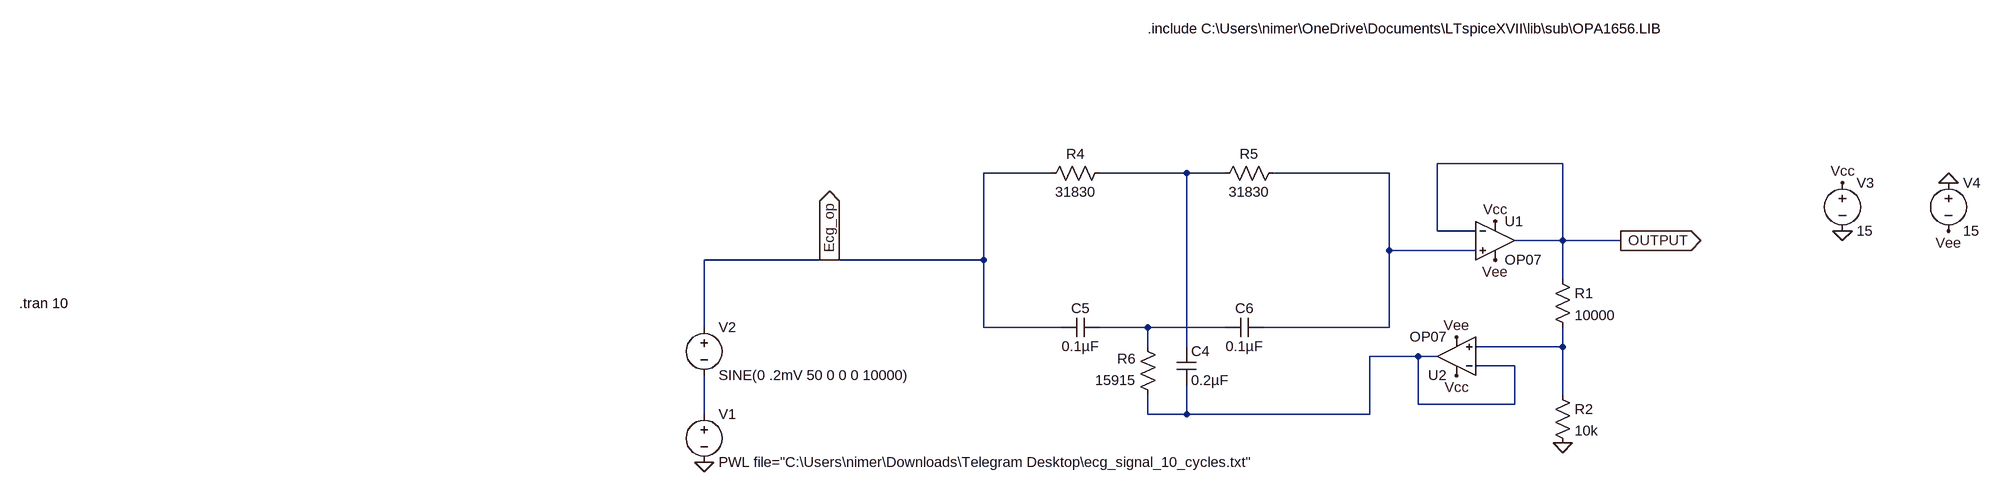
[diagram p0: schematic Twin T notch filter.asc]
Twin T notch filter.asc, the LTspice schematic file:
Version 4
SHEET 1 3288 680
WIRE 2592 16 2384 16
WIRE 1744 32 1632 32
WIRE 1968 32 1824 32
WIRE 2032 32 1968 32
WIRE 2304 32 2112 32
WIRE 2384 128 2384 16
WIRE 2448 128 2384 128
WIRE 2592 144 2592 16
WIRE 2592 144 2512 144
WIRE 2688 144 2592 144
WIRE 2304 160 2304 32
WIRE 2448 160 2304 160
WIRE 1376 176 1168 176
WIRE 1632 176 1632 32
WIRE 1632 176 1376 176
WIRE 2592 208 2592 144
WIRE 1168 288 1168 176
WIRE 1632 288 1632 176
WIRE 1760 288 1632 288
WIRE 1904 288 1824 288
WIRE 2032 288 1904 288
WIRE 2304 288 2304 160
WIRE 2304 288 2096 288
WIRE 1904 320 1904 288
WIRE 1968 320 1968 32
WIRE 2592 320 2592 288
WIRE 2592 320 2448 320
WIRE 2352 336 2272 336
WIRE 2384 336 2352 336
WIRE 2512 352 2448 352
WIRE 2592 400 2592 320
WIRE 2352 416 2352 336
WIRE 2512 416 2512 352
WIRE 2512 416 2352 416
WIRE 1168 432 1168 368
WIRE 1904 432 1904 400
WIRE 1968 432 1968 384
WIRE 1968 432 1904 432
WIRE 2272 432 2272 336
WIRE 2272 432 1968 432
FLAG 1168 512 0
FLAG 1376 176 Ecg_op
IOPIN 1376 176 Out
FLAG 2592 480 0
FLAG 2480 112 Vcc
FLAG 2416 304 Vee
FLAG 2416 368 Vcc
FLAG 2480 176 Vee
FLAG 2688 144 OUTPUT
IOPIN 2688 144 Out
FLAG 3232 48 0
FLAG 3056 128 0
FLAG 3232 128 Vee
FLAG 3056 48 Vcc
SYMBOL voltage 1168 416 R0
WINDOW 123 0 0 Left 0
WINDOW 39 0 0 Left 0
SYMATTR InstName V1
SYMATTR Value PWL file="C:\Users\nimer\Downloads\Telegram Desktop\ecg_signal_10_cycles.txt"
SYMBOL voltage 1168 272 R0
WINDOW 123 0 0 Left 0
WINDOW 39 0 0 Left 0
SYMATTR InstName V2
SYMATTR Value SINE(0 .2mV 50 0 0 0 10000)
SYMBOL res 1840 16 R90
WINDOW 0 0 56 VBottom 2
WINDOW 3 32 56 VTop 2
SYMATTR InstName R4
SYMATTR Value 31830
SYMBOL res 2128 16 R90
WINDOW 0 0 56 VBottom 2
WINDOW 3 32 56 VTop 2
SYMATTR InstName R5
SYMATTR Value 31830
SYMBOL res 1920 416 R180
WINDOW 0 36 76 Left 2
WINDOW 3 36 40 Left 2
SYMATTR InstName R6
SYMATTR Value 15915
SYMBOL cap 1952 320 R0
SYMATTR InstName C4
SYMATTR Value 0.2µF
SYMBOL cap 1824 272 R90
WINDOW 0 0 32 VBottom 2
WINDOW 3 32 32 VTop 2
SYMATTR InstName C5
SYMATTR Value 0.1µF
SYMBOL cap 2096 272 R90
WINDOW 0 0 32 VBottom 2
WINDOW 3 32 32 VTop 2
SYMATTR InstName C6
SYMATTR Value 0.1µF
SYMBOL res 2576 192 R0
SYMATTR InstName R1
SYMATTR Value 10000
SYMBOL res 2576 384 R0
SYMATTR InstName R2
SYMATTR Value 10k
SYMBOL voltage 3056 32 R0
WINDOW 123 0 0 Left 0
WINDOW 39 0 0 Left 0
SYMATTR InstName V3
SYMATTR Value 15
SYMBOL voltage 3232 32 R0
WINDOW 123 0 0 Left 0
WINDOW 39 0 0 Left 0
SYMATTR InstName V4
SYMATTR Value 15
SYMBOL OpAmps\\OP07 2480 80 R0
SYMATTR InstName U1
SYMBOL OpAmps\\OP07 2416 400 R180
SYMATTR InstName U2
TEXT 32 248 Left 2 !.tran 10
TEXT 1904 -208 Left 2 !.include C:\\Users\\nimer\\OneDrive\\Documents\\LTspiceXVII\\lib\\sub\\OPA1656.LIB

The netlist it stands for:
* Twin T notch filter.asc
V1 N006 0 PWL file="C:\Users\nimer\Downloads\Telegram Desktop\ecg_signal_10_cycles.txt"
V2 Ecg_op N006 SINE(0 .2mV 50 0 0 0 10000)
R4 N001 Ecg_op 31830
R5 N002 N001 31830
R6 N005 N003 15915
C4 N001 N005 0.2µF
C5 N003 Ecg_op 0.1µF
C6 N002 N003 0.1µF
R1 OUTPUT N004 10000
R2 N004 0 10k
V3 Vcc 0 15
V4 0 Vee 15
XU1 N002 OUTPUT Vcc Vee OUTPUT LT1001  ; OP07, pins In+ In- V+ V- OUT
XU2 N004 N005 Vcc Vee N005 LT1001  ; OP07, pins In+ In- V+ V- OUT
.tran 10
.include C:\Users\nimer\OneDrive\Documents\LTspiceXVII\lib\sub\OPA1656.LIB
.lib LTC.lib
.backanno
.end